# Altium schematic sheet Boost converter.SchDoc: BOOST CONVERTER
size 431 x 279 mm; Date: 02/07/2022; ApprovedBy: RTZ,HYW; CheckedBy: RTZ,HYW; Author: RTZ,HYW; CompanyName: Upenn; DrawnBy: RTZ,HYW; Engineer: RTZ,HYW; Organization: Upenn ESE; Address1: Electrical Engineering; Address2: 200 South 33rd St; Address3: Philadelphia; Address4: PA, 19104; SheetNumber: 8; SheetTotal: 11; ENG_APP_DATE: 02/15/22; DSN_APP_DATE: 02/15/22; CHK_APP_DATE: 02/15/22; DOC_NO_ASSY_DWG: TBD; DOC_NO_FAB_DWG: TBD; PCB_DWG_NO: TBD; Project: SimonSayGame; DESIGN_ITEM: 1.0; CAGE_CODE: TBD; DOC_NO_SCH_DWG: TBD; SCH_SCALE: NA; Time: 13:18
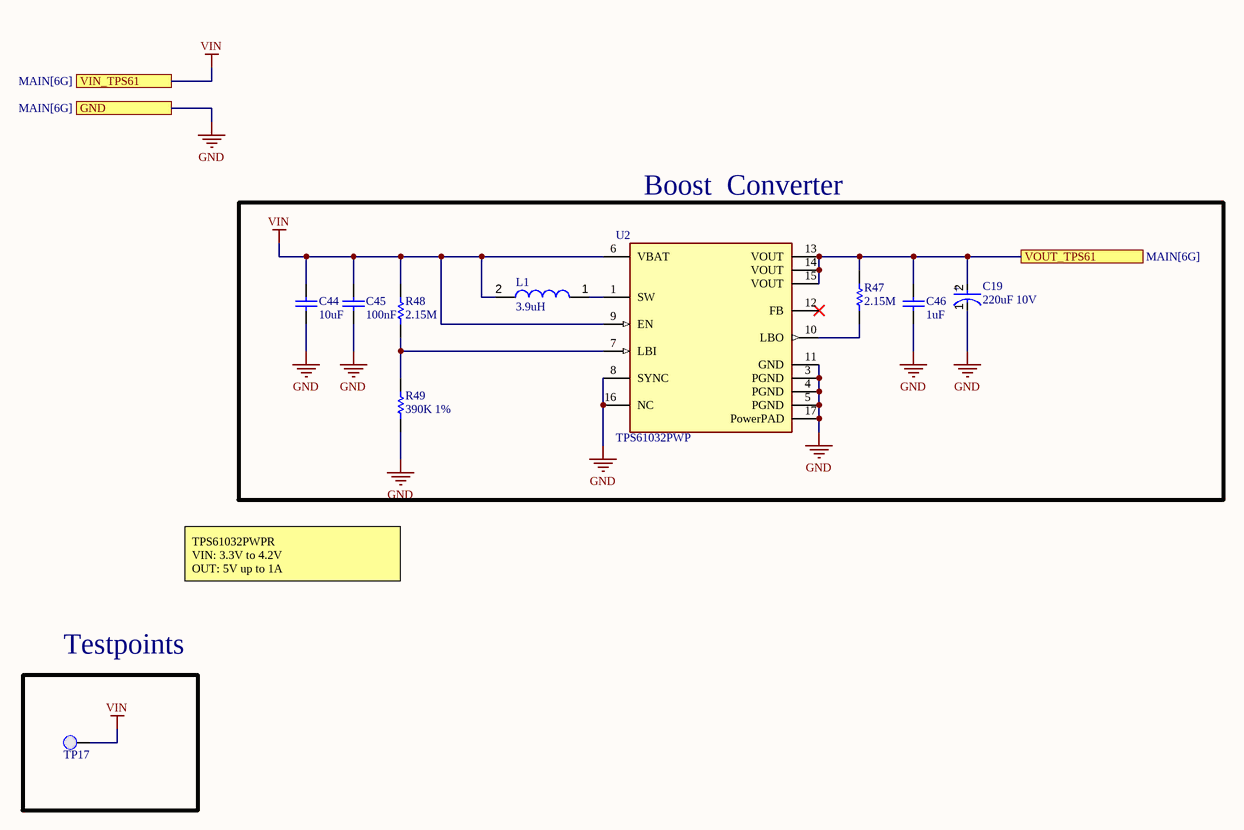
[diagram p0: Boost converter.SchDoc]

## Parts
C19  220uF 10V  [FP-T495D227K010ATE100-MFG]
C44  10uF  [CAPC2012X127N]
C45  100nF  [CAPC1005X55X25LL05T10]
C46  1uF  [CAPC1608X90]
L1  3.9uH  [7843330390]
R47  2.15M  [RESC1005X40X25ML05T05]
R48  2.15M  [RESC1005X40X25ML05T05]
R49  390K 1%  [RESC0603(1608)_M]
TP17  0.1" Pad  [PCBComponent]  (value not drawn)  (no BOM)
U2  TPS61032PWP  [FP-PWP0016C-MFG]

## Blocks framed on the sheet
Boost  Converter: C19 C44-C46 L1 R47-R49 U2
Testpoints: TP17

## Ports
GND (see MAIN[6G]), VIN_TPS61 (see MAIN[6G]), VOUT_TPS61 (see MAIN[6G])

## Nets
GND: C19.1(C) C44.1 C45.1 C46.1 R49.1 U2.3(PGND) U2.4(PGND) U2.5(PGND) U2.8(SYNC) U2.11(GND) U2.16(NC) U2.17(PowerPAD) ; port GND
VIN: C44.2 C45.2 L1.2 R48.2 TP17.1(PAD) U2.6(VBAT) U2.9(EN) ; port VIN_TPS61
VOUT_TPS61: C19.2(A) C46.2 R47.2 U2.13(VOUT) U2.14(VOUT) U2.15(VOUT) ; port VOUT_TPS61
NetL1_1: L1.1 U2.1(SW)
NetR47_1: R47.1 U2.10(LBO)
NetR48_1: R48.1 R49.2 U2.7(LBI)

Not connected (* = marked no-connect by the designer): U2 12(FB)*

## Notes on the sheet
- TPS61032PWPR
  VIN: 3.3V to 4.2V
  OUT: 5V up to 1A
- DWG. NO.
- REV.
- SHT.
- THIS DOCUMENT AND THE DATA DISCLOSED HEREIN OR HEREWITH IS THE PROPERTY OF ALTIUM LIMITED AND MAY BE FREELY DISTRIBUTED IN WHOLE. NO RIGHTS ARE RESERVED OR EXPRESS OR IMPLIED WARANTEE GIVEN.
- REVISION
- DESCRIPTION
- DATE
- APPROVED
- ENG:
- APPROVALS
- PROJECT
- DSN:
- CHK:
- REFERENCE DOCUMENTS
- PROJECT REVISION:
- TITLE
- DOCUMENT REVISION:
- DESIGN ITEM:
- BOM:
- FAB DWG:
- PCB DWG:
- ASSY DWG:
- SCALE:
- SIZE
- B
- CAGE CODE
- FILE NAME
- DWG NO.
- SHEET
- OF
- REV
- (in symbol CMP-03017-000025-1) +

## Library data of the parts
C19 = CMP-03017-000025-1: CAP TANT 220UF 10% 10V 2917, T495D227K010ATE100; Life (Hours): 2000Hour; Dielectric Material: Tantalum; Ripple Current: 1.225A; Dissipation Factor: 8%; ESR (Equivalent Series Resistance): 100mR; Leakage Current: 22uA; Polarity: Polar; Max Operating Temperature: 125°C; Features: General Purpose; Voltage Rating: 10V; Depth: 4.3mm; Case Code (Imperial): 2917; Length: 7.3mm; Package Quantity: 1; Mount: Surface Mount; Min Operating Temperature: -55°C; Termination: SMD/SMT; Voltage Rating (DC): 10V; Height: 2.8mm; Construction: Flat; Case Code (Metric): 7343; Radiation Hardening: No; Number of Pins: 2; Series: T495; Tolerance: 10%; Capacitance: 220uF; Case/Package: 2917; Lead Pitch: 3.8mm; RoHS Compliant: Yes; Width: 0.169inch; Packaging: Tape and Reel; Voltage: 10V; Height - Seated (Max): 0.122inch; REACH SVHC: No SVHC
C44 = CMP-06035-062410-1: Boost Cin, Buck Cin-Cap Ceramic 10uF 16V X7R 20% SMD 0805 125°C Blister T/R; Manufacturer: Murata; Manufacturer Part Number: GRJ155R60J106ME11D; Voltage Rating: 6.3V; Length: 0.039inch; Width: 0.02inch; Capacitance: 10uF; Max Operating Temperature: 85°C; Features: Soft Termination; Case Code (Metric): 1005; Tolerance: 20%; Min Operating Temperature: -55°C; Thickness: 0.028inch; Mount: Surface Mount; Packaging: Cut Tape; Case/Package: 0402; Case Code (Imperial): 0402; RoHS Compliant: Yes; Supplier 1: Digi-Key; Supplier Part Number 1: 490-13211-2-ND; RoHS: Yes; Category: Ceramic Capacitors; Stock 1: 1752680; Pricing 1: 10000=0.03490, 20000=0.03307 (USD); ComponentLink1URL: http://psearch.en.murata.com/capacitor/product/GRJ155R60J106ME11%23.pdf?src-supplier=Digi-Key; ComponentLink1Description: http://psearch.en.murata.com/capacitor/product/GRJ155R60J106ME11%23.pdf?src-supplier=Digi-Key; Supplier 2: Digi-Key; Supplier Part Number 2: 311-1338-2-ND; Stock 2: 27298742; Pricing 2: 10000=0.00554, 20000=0.00528 (USD); Number of Pins: 2; Dielectric: X7R; Voltage Rating (DC): 16V; Package Quantity: 1; Termination: SMD/SMT; Resistor Type: Ceramic; Voltage: 16V; Series: CC; Height: 0.5mm; Depth: 0.5mm; Radiation Hardening: No; REACH SVHC: No SVHC; Lead Free: Lead Free; Halogen Free: Halogen Free; ComponentLink2URL: https://datasheet.ciiva.com/11788/0900766b80ce67ed-11788364.pdf?src-supplier=RSComponents; ComponentLink2Description: https://datasheet.ciiva.com/11788/0900766b80ce67ed-11788364.pdf?src-supplier=RSComponents; ComponentLink3URL: https://datasheet.ciiva.com/7978/1489800-7978111.pdf?src-supplier=Element14; ComponentLink3Description: https://datasheet.ciiva.com/7978/1489800-7978111.pdf?src-supplier=Element14; ComponentLink4URL: https://datasheet.ciiva.com/28450/1489800-28450335.pdf?src-supplier=Element14; ComponentLink4Description: https://datasheet.ciiva.com/28450/1489800-28450335.pdf?src-supplier=Element14; ComponentLink5URL: https://datasheet.ciiva.com/161/mlccorderingcode-161545.pdf?src-supplier=Digi-Key; ComponentLink5Description: https://datasheet.ciiva.com/161/mlccorderingcode-161545.pdf?src-supplier=Digi-Key; ComponentLink6URL: https://datasheet.ciiva.com/161/mlccorderingcode-161544.pdf?src-supplier=Digi-Key; ComponentLink6Description: https://datasheet.ciiva.com/161/mlccorderingcode-161544.pdf?src-supplier=Digi-Key; ComponentLink7URL: https://datasheet.ciiva.com/161/mlccorderingcode-161546.pdf?src-supplier=Digi-Key; ComponentLink7Description: https://datasheet.ciiva.com/161/mlccorderingcode-161546.pdf?src-supplier=Digi-Key; ComponentLink8URL: https://datasheet.ciiva.com/13395/upy-gphc-x7r-6-3v-to-50v-8-13395676.pdf?src-supplier=Mouser; ComponentLink8Description: https://datasheet.ciiva.com/13395/upy-gphc-x7r-6-3v-to-50v-8-13395676.pdf?src-supplier=Mouser; ComponentLink9URL: https://datasheet.ciiva.com/11587/upy-gphc-x7r-6-3v-to-50v-8-11587305.pdf?src-supplier=Avnet; ComponentLink9Description: https://datasheet.ciiva.com/11587/upy-gphc-x7r-6-3v-to-50v-8-11587305.pdf?src-supplier=Avnet; ComponentLink10URL: https://datasheet.ciiva.com/8033/1734573-8033663.pdf?src-supplier=Element14; ComponentLink10Description: https://datasheet.ciiva.com/8033/1734573-8033663.pdf?src-supplier=Element14; ComponentLink11URL: https://datasheet.ciiva.com/8033/1734573-8033661.pdf?src-supplier=Element14; ComponentLink11Description: https://datasheet.ciiva.com/8033/1734573-8033661.pdf?src-supplier=Element14; ComponentLink12URL: https://datasheet.ciiva.com/16625/upy-gphc-x7r-6-3v-to-50v-8-16625511.pdf?src-supplier=Avnet+Europe; ComponentLink12Description: https://datasheet.ciiva.com/16625/upy-gphc-x7r-6-3v-to-50v-8-16625511.pdf?src-supplier=Avnet+Europe; Supplier 3: Digi-Key; Supplier Part Number 3: 311-3508-1-ND; Stock 3: 2481; Pricing 3: 1=0.64000, 10=0.45400, 50=0.34360, 100=0.29920, 500=0.22164, 1000=0.18840 (USD); ComponentLink13URL: http://www.yageo.com/documents/recent/UPY-GPHC_X7R_6.3V-to-50V_18.pdf?src-supplier=Digi-Key; ComponentLink13Description: http://www.yageo.com/documents/recent/UPY-GPHC_X7R_6.3V-to-50V_18.pdf?src-supplier=Digi-Key; ComponentLink14URL: https://datasheet.octopart.com/CC0805MKX7R7BB106-Yageo-datasheet-10883670.pdf; ComponentLink14Description: https://datasheet.octopart.com/CC0805MKX7R7BB106-Yageo-datasheet-10883670.pdf; ComponentLink15URL: https://datasheet.octopart.com/Surface-Mount-Ceramic-Multilayer-Capacitors%3B-General-Purpose-%26-High-Capacitance-Class-2%2C-X7R-Yageo-datasheet-family-114.pdf; ComponentLink15Description: https://datasheet.octopart.com/Surface-Mount-Ceramic-Multilayer-Capacitors%3B-General-Purpose-%26-High-Capacitance-Class-2%2C-X7R-Yageo-datasheet-family-114.pdf; ComponentLink16URL: https://datasheet.octopart.com/CC0805MKX7R7BB106-Yageo-datasheet-147453679.pdf?src-supplier=Future+Electronics; ComponentLink16Description: https://datasheet.octopart.com/CC0805MKX7R7BB106-Yageo-datasheet-147453679.pdf?src-supplier=Future+Electronics
C45 = CMP-2000-06331-1: Boost Cinx, Cap 100NF 16V 0402 SMD 10% X7R; Manufacturer: Murata; Manufacturer Part Number: GRM155R71A104KA01D; Rated Voltage: 10V; Capacitance: 100000pF; Dissipation Factor: 0.035%; Manufacturer URL: http://www.murata.com/; Datasheet Version: 02/2016; Datasheet URL: http://search.murata.co.jp/Ceramy/image/img/A01X/G101/ENG/GRM155R71A104KA01-01.pdf; Dielectric: X7R; Package Reference: 0402; Tolerance (%): ±10%; Package Description: 2-Pin Surface Mount Device, Body 1 x 0.5 mm; Mounting Technology: SurfaceMount; Case Size/Dimension: 0402; Supplier 1: Digi-Key; Supplier Part Number 1: 490-6321-1-ND; RoHS: Yes; Category: Ceramic Capacitors; Stock 1: 5059; Pricing 1: 1=0.10000, 10=0.02300, 50=0.01260, 100=0.01030, 500=0.00736, 1000=0.00578, 2500=0.00525, 5000=0.00483 (USD); Mount: Surface Mount; Case/Package: 0402; Number of Pins: 2; Case Code (Metric): 1005; Case Code (Imperial): 0402; Min Operating Temperature: -55°C; Max Operating Temperature: 125°C; Tolerance: 10%; Package Quantity: 1; Voltage Rating: 10V; Packaging: Tape and Reel; Voltage Rating (DC): 10V; Termination: SMD/SMT; Voltage: 10V; Series: GRM; Construction: Flat; Length: 1mm; Width: 0.02inch; Height: 0.5mm; Thickness: 0.022inch; Depth: 0.5mm; Size: 0.5mm; Radiation Hardening: No; REACH SVHC: No SVHC; Lead Free: Lead Free; RoHS Compliant: Yes; ComponentLink1URL: https://datasheet.ciiva.com/6271/product-6271137.pdf?src-supplier=Digi-Key; ComponentLink1Description: https://datasheet.ciiva.com/6271/product-6271137.pdf?src-supplier=Digi-Key; ComponentLink2URL: https://datasheet.ciiva.com/19475/1856345-19475961.pdf?src-supplier=Jameco; ComponentLink2Description: https://datasheet.ciiva.com/19475/1856345-19475961.pdf?src-supplier=Jameco; ComponentLink3URL: https://datasheet.ciiva.com/11789/0900766b80ef921d-11789061.pdf?src-supplier=RSComponents; ComponentLink3Description: https://datasheet.ciiva.com/11789/0900766b80ef921d-11789061.pdf?src-supplier=RSComponents; ComponentLink4URL: https://datasheet.ciiva.com/7937/1747441-7937613.pdf?src-supplier=Element14; ComponentLink4Description: https://datasheet.ciiva.com/7937/1747441-7937613.pdf?src-supplier=Element14; ComponentLink5URL: https://datasheet.ciiva.com/18184/getdatasheetpartid-130330-18184636.pdf?src-supplier=Verical; ComponentLink5Description: https://datasheet.ciiva.com/18184/getdatasheetpartid-130330-18184636.pdf?src-supplier=Verical; ComponentLink6URL: https://datasheet.ciiva.com/6271/partnumbering-e-01-6271135.pdf?src-supplier=Digi-Key; ComponentLink6Description: https://datasheet.ciiva.com/6271/partnumbering-e-01-6271135.pdf?src-supplier=Digi-Key; ComponentLink7URL: https://datasheet.ciiva.com/16199/c02e-16199258.pdf?src-supplier=Future+Electronics; ComponentLink7Description: https://datasheet.ciiva.com/16199/c02e-16199258.pdf?src-supplier=Future+Electronics; Supplier 2: Digi-Key; Supplier Part Number 2: 311-1338-2-ND; Stock 2: 27298742; Pricing 2: 10000=0.00554, 20000=0.00528 (USD); Resistor Type: Ceramic; Halogen Free: Halogen Free; ComponentLink8URL: https://datasheet.ciiva.com/11788/0900766b80ce67ed-11788364.pdf?src-supplier=RSComponents; ComponentLink8Description: https://datasheet.ciiva.com/11788/0900766b80ce67ed-11788364.pdf?src-supplier=RSComponents; ComponentLink9URL: https://datasheet.ciiva.com/7978/1489800-7978111.pdf?src-supplier=Element14; ComponentLink9Description: https://datasheet.ciiva.com/7978/1489800-7978111.pdf?src-supplier=Element14; ComponentLink10URL: https://datasheet.ciiva.com/28450/1489800-28450335.pdf?src-supplier=Element14; ComponentLink10Description: https://datasheet.ciiva.com/28450/1489800-28450335.pdf?src-supplier=Element14; ComponentLink11URL: https://datasheet.ciiva.com/161/mlccorderingcode-161545.pdf?src-supplier=Digi-Key; ComponentLink11Description: https://datasheet.ciiva.com/161/mlccorderingcode-161545.pdf?src-supplier=Digi-Key; ComponentLink12URL: https://datasheet.ciiva.com/161/mlccorderingcode-161544.pdf?src-supplier=Digi-Key; ComponentLink12Description: https://datasheet.ciiva.com/161/mlccorderingcode-161544.pdf?src-supplier=Digi-Key; ComponentLink13URL: https://datasheet.ciiva.com/161/mlccorderingcode-161546.pdf?src-supplier=Digi-Key; ComponentLink13Description: https://datasheet.ciiva.com/161/mlccorderingcode-161546.pdf?src-supplier=Digi-Key; ComponentLink14URL: https://datasheet.ciiva.com/13395/upy-gphc-x7r-6-3v-to-50v-8-13395676.pdf?src-supplier=Mouser; ComponentLink14Description: https://datasheet.ciiva.com/13395/upy-gphc-x7r-6-3v-to-50v-8-13395676.pdf?src-supplier=Mouser; ComponentLink15URL: https://datasheet.ciiva.com/11587/upy-gphc-x7r-6-3v-to-50v-8-11587305.pdf?src-supplier=Avnet; ComponentLink15Description: https://datasheet.ciiva.com/11587/upy-gphc-x7r-6-3v-to-50v-8-11587305.pdf?src-supplier=Avnet; ComponentLink16URL: https://datasheet.ciiva.com/8033/1734573-8033663.pdf?src-supplier=Element14; ComponentLink16Description: https://datasheet.ciiva.com/8033/1734573-8033663.pdf?src-supplier=Element14; ComponentLink17URL: https://datasheet.ciiva.com/8033/1734573-8033661.pdf?src-supplier=Element14; ComponentLink17Description: https://datasheet.ciiva.com/8033/1734573-8033661.pdf?src-supplier=Element14; ComponentLink18URL: https://datasheet.ciiva.com/16625/upy-gphc-x7r-6-3v-to-50v-8-16625511.pdf?src-supplier=Avnet+Europe; ComponentLink18Description: https://datasheet.ciiva.com/16625/upy-gphc-x7r-6-3v-to-50v-8-16625511.pdf?src-supplier=Avnet+Europe
C46 = C0603C105K8PACTU: Boost Coutx, Cap Ceramic 1uF 16V X7R 5% SMD 0603 125°C Paper T/R; Manufacturer: KEMET; MF: {'manufacturer': u'KEMET'}; Tolerance: 10%; Dielectric: X5R; Voltage: 10V; Value: *; Package: None; MP: C0603C105K8PACTU; Price: None; Availability: Unavailable; Supplier 1: Digi-Key; Supplier Part Number 1: 399-C0603C105K8PAC7867TR-ND; Manufacturer Part Number: C0603C105K8PACTU; RoHS: Yes; Category: Ceramic Capacitors; Stock 1: 359436; Pricing 1: 4000=0.01113, 8000=0.01016 (USD); Mount: Surface Mount; Case/Package: 0603; Number of Pins: 2; Dielectric Material: Ceramic; Case Code (Imperial): 0603; Case Code (Metric): 1608; Weight: 7.1E-05oz; Min Operating Temperature: -55°C; Max Operating Temperature: 85°C; Capacitance: 1uF; Packaging: Tape and Reel; Termination: SMD/SMT; Voltage Rating (DC): 10V; Package Quantity: 1; Voltage Rating: 10V; Series: C; Construction: Flat; Length: 1.6mm; Width: 0.031inch; Height: 0.8mm; Depth: 0.8mm; Thickness: 0.035inch; Radiation Hardening: No; Lead Free: Lead Free; REACH SVHC: No SVHC; RoHS Compliant: Yes; ComponentLink1URL: https://datasheet.ciiva.com/11787/0900766b8116eb59-11787747.pdf?src-supplier=RSComponents; ComponentLink1Description: https://datasheet.ciiva.com/11787/0900766b8116eb59-11787747.pdf?src-supplier=RSComponents; ComponentLink2URL: https://datasheet.ciiva.com/6074/40889-6074647.pdf?src-supplier=Farnell; ComponentLink2Description: https://datasheet.ciiva.com/6074/40889-6074647.pdf?src-supplier=Farnell; ComponentLink3URL: https://datasheet.ciiva.com/26847/getdatasheetpartid-385480-26847548.pdf?src-supplier=Verical; ComponentLink3Description: https://datasheet.ciiva.com/26847/getdatasheetpartid-385480-26847548.pdf?src-supplier=Verical; ComponentLink4URL: https://datasheet.ciiva.com/7823/40889-7823998.pdf?src-supplier=Element14; ComponentLink4Description: https://datasheet.ciiva.com/7823/40889-7823998.pdf?src-supplier=Element14; ComponentLink5URL: https://datasheet.ciiva.com/7823/1929483-7823999.pdf?src-supplier=Element14; ComponentLink5Description: https://datasheet.ciiva.com/7823/1929483-7823999.pdf?src-supplier=Element14; ComponentLink6URL: https://datasheet.ciiva.com/28645/1831760-28645655.pdf?src-supplier=Element14; ComponentLink6Description: https://datasheet.ciiva.com/28645/1831760-28645655.pdf?src-supplier=Element14; Supplier 2: Digi-Key; Supplier Part Number 2: 13-CC0603JRX7R7BB102CT-ND; Stock 2: 33465; Pricing 2: 1=0.10000, 10=0.07000, 50=0.03800, 100=0.03100, 500=0.02218, 1000=0.01742 (USD); Halogen Free: Halogen Free; ComponentLink7URL: https://datasheet.ciiva.com/11494/upy-gphc-x7r-6-3v-to-50v-8-11494730.pdf?src-supplier=Avnet; ComponentLink7Description: https://datasheet.ciiva.com/11494/upy-gphc-x7r-6-3v-to-50v-8-11494730.pdf?src-supplier=Avnet; Supplier 3: Digi-Key; Supplier Part Number 3: 311-3485-1-ND; Stock 3: 56081; Pricing 3: 1=0.26000, 10=0.17800, 50=0.10680, 100=0.09020, 500=0.06174, 1000=0.05462 (USD); ComponentLink8URL: http://www.yageo.com/documents/recent/UPY-GPHC_X7R_6.3V-to-50V_18.pdf?src-supplier=Digi-Key; ComponentLink8Description: http://www.yageo.com/documents/recent/UPY-GPHC_X7R_6.3V-to-50V_18.pdf?src-supplier=Digi-Key
L1 = 7843330390: Boost L1-Inductor, Aec-Q200, 3.9Uh, Shld, 11.2A Rohs Compliant: Yes; Manufacturer: Wurth Electronics; Supplier 1: Digi-Key; Supplier Part Number 1: 732-11759-1-ND; Manufacturer Part Number: 7843330390; RoHS: Yes; Stock 1: 334; Pricing 1: 1=2.77000, 10=2.71300, 50=2.50400, 100=2.39900 (USD); RoHS Compliant: No
R47 R48 = CMP-2002-00322-1: Boost Rlbt-Res Thick Film 0402 2.15M Ohm 1% 1/16W ±100ppm/°C Molded SMD SMD Paper T/R; Manufacturer: Vishay Dale; Part Number: CRCW04022M15FKED; Resistance: 2.15MR; Max Power Dissipation: 63mW; Voltage Rating: 50V; Supplier 1: Digi-Key; Supplier Part Number 1: 541-2.15MLCT-ND; Manufacturer Part Number: CRCW04022M15FKED; RoHS: Yes; Category: Chip SMD Resistors; Stock 1: 790; Pricing 1: 1=0.10000, 10=0.03800, 100=0.01530, 1000=0.00686, 2500=0.00595, 5000=0.00492 (USD); Case/Package: 0402; Number of Pins: 2; Weight: 2.3E-05oz; Case Code (Metric): 1005; Case Code (Imperial): 0402; Contact Plating: Tin; Min Operating Temperature: -55°C; Max Operating Temperature: 155°C; Packaging: Tape and Reel; Tolerance: 1%; Resistor Type: Thick Film; Number of Terminations: 2; Temperature Coefficient: 100ppm/°C; Power Rating: 63mW; Package Quantity: 10000; Termination: SMD/SMT; Voltage Rating (DC): 50V; Features: Automotive AEC-Q200; Series: CRCW; Construction: Rectangular; Resistance Tolerance: 1%; Length: 1mm; Width: 0.02inch; Height: 0.016inch; Depth: 0.5mm; Radiation Hardening: No; RoHS Compliant: Yes; REACH SVHC: Unknown; Military Standard: Not; Lead Free: Lead Free; ComponentLink1URL: https://datasheet.ciiva.com/9091/dcrcwe3-9091823.pdf?src-supplier=Avnet; ComponentLink1Description: https://datasheet.ciiva.com/9091/dcrcwe3-9091823.pdf?src-supplier=Avnet; ComponentLink2URL: https://datasheet.ciiva.com/2464/dcrcwe3-2464648.pdf?src-supplier=Digi-Key; ComponentLink2Description: https://datasheet.ciiva.com/2464/dcrcwe3-2464648.pdf?src-supplier=Digi-Key; ComponentLink3URL: https://datasheet.ciiva.com/2464/dcrcwe3-2464649.pdf?src-supplier=Digi-Key; ComponentLink3Description: https://datasheet.ciiva.com/2464/dcrcwe3-2464649.pdf?src-supplier=Digi-Key; ComponentLink4URL: https://datasheet.ciiva.com/2464/dcrcwe3-2464650.pdf?src-supplier=Digi-Key; ComponentLink4Description: https://datasheet.ciiva.com/2464/dcrcwe3-2464650.pdf?src-supplier=Digi-Key; ComponentLink5URL: https://datasheet.ciiva.com/5543/dcrcwe3-109170-5543499.pdf?src-supplier=Mouser; ComponentLink5Description: https://datasheet.ciiva.com/5543/dcrcwe3-109170-5543499.pdf?src-supplier=Mouser; ComponentLink6URL: https://datasheet.ciiva.com/22708/1697337-22708317.pdf?src-supplier=Element14; ComponentLink6Description: https://datasheet.ciiva.com/22708/1697337-22708317.pdf?src-supplier=Element14; ComponentLink7URL: https://datasheet.ciiva.com/7801/1697337-7801003.pdf?src-supplier=Element14; ComponentLink7Description: https://datasheet.ciiva.com/7801/1697337-7801003.pdf?src-supplier=Element14; ComponentLink8URL: https://datasheet.ciiva.com/7801/1697337-7801004.pdf?src-supplier=Element14; ComponentLink8Description: https://datasheet.ciiva.com/7801/1697337-7801004.pdf?src-supplier=Element14
R49 = CMP-1012-00802-1: Boost Rlbb-Res Thick Film 0603 390K Ohm 1% 0.1W(1/10W) ±100ppm/C Pad SMD T/R; Manufacturer: Yageo; Manufacturer Part Number: RC0603FR-07390KL; Case-EIA: 0603; Case-Metric: 1608; Value: 390000.00 Ohm; Resistance: 390kR; Power Rating: 100mW; Voltage Rating: 50V; Temperature Coefficient: 100ppm/°C; Working Voltage: 75V; Power: 0.1 W; Technology: SMT; Tolerance: 1 %; Supplier 1: Digi-Key; Supplier Part Number 1: 311-390KHRCT-ND; RoHS: Yes; Category: Chip SMD Resistors; Stock 1: 129633; Pricing 1: 1=0.10000, 10=0.02400, 100=0.00970, 1000=0.00436, 2500=0.00378 (USD); Case/Package: 0603; Number of Pins: 2; Case Code (Imperial): 0603; Case Code (Metric): 1608; Min Operating Temperature: -55°C; Max Operating Temperature: 155°C; Packaging: Tape and Reel; Voltage Rating (DC): 50V; Package Quantity: 1; Termination: SMD/SMT; Resistor Type: Thick Film; Number of Terminations: 2; Max Power Dissipation: 100mW; Features: Moisture Resistant; Series: RC; Resistance Tolerance: 1%; Construction: Rectangular; Length: 1.6mm; Width: 0.031inch; Height: 0.022inch; Depth: 0.8mm; REACH SVHC: Unknown; Military Standard: Not; Lead Free: Lead Free; RoHS Compliant: Yes; ComponentLink1URL: https://datasheet.ciiva.com/5557/rc0603-5557952.pdf?src-supplier=Mouser; ComponentLink1Description: https://datasheet.ciiva.com/5557/rc0603-5557952.pdf?src-supplier=Mouser; ComponentLink2URL: https://datasheet.ciiva.com/11819/0900766b80f96399-11819357.pdf?src-supplier=RSComponents; ComponentLink2Description: https://datasheet.ciiva.com/11819/0900766b80f96399-11819357.pdf?src-supplier=RSComponents; ComponentLink3URL: https://datasheet.ciiva.com/2454/pyu-r-int-thick-7-2454246.pdf?src-supplier=Digi-Key; ComponentLink3Description: https://datasheet.ciiva.com/2454/pyu-r-int-thick-7-2454246.pdf?src-supplier=Digi-Key; ComponentLink4URL: https://datasheet.ciiva.com/2454/pyu-r-int-thick-7-2454247.pdf?src-supplier=Digi-Key; ComponentLink4Description: https://datasheet.ciiva.com/2454/pyu-r-int-thick-7-2454247.pdf?src-supplier=Digi-Key; ComponentLink5URL: https://datasheet.ciiva.com/2454/pyu-r-int-thick-7-2454248.pdf?src-supplier=Digi-Key; ComponentLink5Description: https://datasheet.ciiva.com/2454/pyu-r-int-thick-7-2454248.pdf?src-supplier=Digi-Key
TP17 = 0.1" Pad-A.4
U2 = CMP-04918-000601-1: IC REG BOOST 5V 3.6A 16HTSSOP; Max Output Current: 1A; Number of Outputs: 1; Synchronous Rectifier: Yes; Switching Frequency: 600kHz; Output Type: Fixed; Current Rating: 20mA; Max Input Voltage: 5.5V; Output Configuration: Positive; Quiescent Current: 20uA; Efficiency: 96%; Min Input Voltage: 1.8V; Package Quantity: 1; Max Operating Temperature: 85°C; Output Current: 1A; Min Operating Temperature: -40°C; Min Output Voltage: 5V; Topology: Boost; RoHS Compliant: Yes; Number of Pins: 16; Case/Package: HTSSOP; Series: -; Output Voltage: 5V; Mount: Surface Mount; Lead Free: Lead Free; Weight: 0.002212oz; Radiation Hardening: No; REACH SVHC: No SVHC; Nominal Output Voltage: 5V; Packaging: Tape and Reel; Width: 4.4mm; Operating Supply Voltage: 5.5V